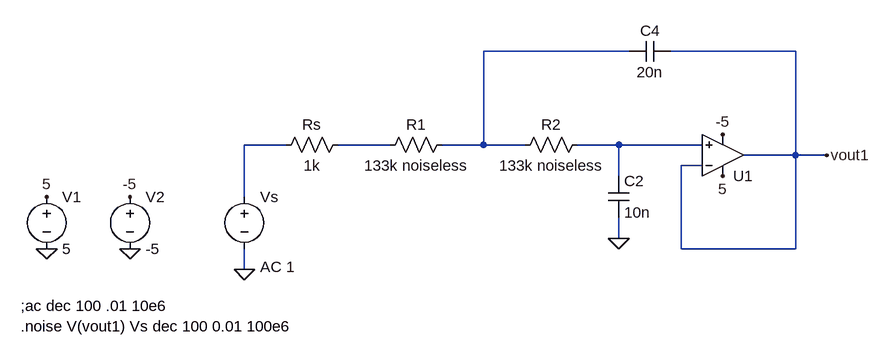
[diagram p0: schematic butterworth_2nd_order_LP.asc]
butterworth_2nd_order_LP.asc, the LTspice schematic file:
Version 4
SHEET 1 880 680
WIRE 464 -32 240 -32
WIRE 720 -32 528 -32
WIRE -64 112 -128 112
WIRE 96 112 16 112
WIRE 240 112 240 -32
WIRE 240 112 176 112
WIRE 304 112 240 112
WIRE 448 112 384 112
WIRE 576 112 448 112
WIRE 720 128 720 -32
WIRE 720 128 640 128
WIRE 768 128 720 128
WIRE 576 144 544 144
WIRE 448 160 448 112
WIRE -128 192 -128 112
WIRE 448 256 448 224
WIRE 544 272 544 144
WIRE 720 272 720 128
WIRE 720 272 544 272
WIRE -128 304 -128 272
FLAG 608 160 5
FLAG 608 96 -5
FLAG 448 256 0
FLAG 768 128 vout1
FLAG -432 192 5
FLAG -304 192 -5
FLAG -432 272 0
FLAG -304 272 0
FLAG -128 304 0
SYMBOL Opamps\\UniversalOpamp2 608 128 M180
SYMATTR InstName U1
SYMATTR Value2 Avol=10Meg GBW=10Meg Slew=10Meg
SYMBOL voltage -432 176 R0
WINDOW 123 0 0 Left 0
WINDOW 39 0 0 Left 0
SYMATTR InstName V1
SYMATTR Value 5
SYMBOL voltage -304 176 R0
WINDOW 123 0 0 Left 0
WINDOW 39 0 0 Left 0
SYMATTR InstName V2
SYMATTR Value -5
SYMBOL res -80 128 R270
WINDOW 0 32 56 VTop 2
WINDOW 3 0 56 VBottom 2
SYMATTR InstName Rs
SYMATTR Value 1k
SYMBOL voltage -128 176 R0
WINDOW 123 24 124 Left 2
WINDOW 39 0 0 Left 0
SYMATTR Value2 AC 1
SYMATTR InstName Vs
SYMATTR Value ""
SYMBOL cap 432 160 R0
SYMATTR InstName C2
SYMATTR Value 10n
SYMBOL cap 528 -48 R90
WINDOW 0 0 32 VBottom 2
WINDOW 3 32 32 VTop 2
SYMATTR InstName C4
SYMATTR Value 20n
SYMBOL res 192 96 R90
WINDOW 0 0 56 VBottom 2
WINDOW 3 32 56 VTop 2
SYMATTR InstName R1
SYMATTR Value 133k noiseless
SYMBOL res 400 96 R90
WINDOW 0 0 56 VBottom 2
WINDOW 3 32 56 VTop 2
SYMATTR InstName R2
SYMATTR Value 133k noiseless
TEXT -472 360 Left 2 !;ac dec 100 .01 10e6\n.noise V(vout1) Vs dec 100 0.01 100e6

The netlist it stands for:
* butterworth_2nd_order_LP.asc
XU1 N004 vout1 5 -5 vout1 level.2 Avol=10Meg GBW=10Meg Slew=10Meg ilimit=25m rail=0 Vos=0 phimargin=45 en=0 enk=0 in=0 ink=0 Rin=500Meg  ; pins IN+ IN- V+ V- OUT
V1 5 0 5
V2 -5 0 -5
Rs N002 N003 1k
Vs N002 0 AC 1
C2 N004 0 10n
C4 vout1 N001 20n
R1 N001 N003 133k noiseless
R2 N004 N001 133k noiseless
;ac dec 100 .01 10e6
.noise V(vout1) Vs dec 100 0.01 100e6
.lib UniversalOpamps2.sub
.backanno
.end